# Altium project ESP_IoT_Dimmer.PrjPcb
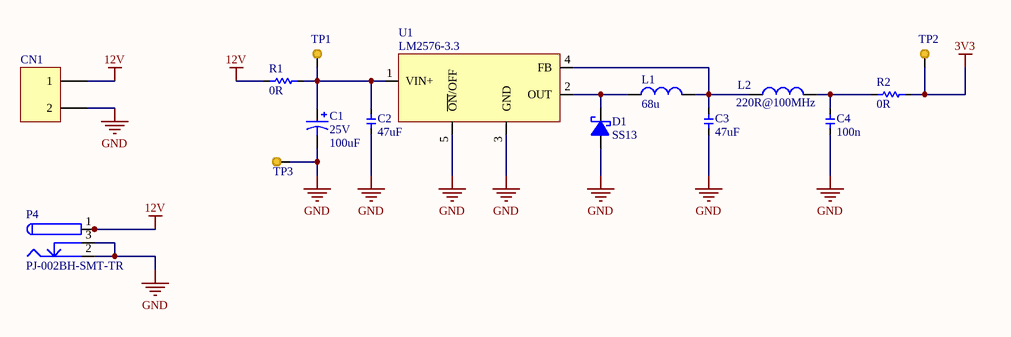
[diagram p0: 01_Power.SchDoc]
4 sheets, 65 parts. Net scope: flat (ports and power ports of the same name join across sheets).
Board file: PCB.PcbDoc
Sheets:
  01_Power.SchDoc
  00_TOP.SchDoc
  02_ESP12.SchDoc
  03_Dimmer.SchDoc

## Sheet 01_Power.SchDoc: Power
size A4; SheetNumber: 1; SheetTotal: 3; PageSetup: Record=PageOptions|CenterHorizontal=True|CenterVertical=True|PrintScale=1.09|XCorrection=1.00|YCorrection=1.00|PrintKind=0|BorderSize=5000000|LeftOffset=0|BottomOffset=0|Orientation=2|PaperLength=1000|PaperWidth=1000|Scale=100|PaperSource=7|PrintQuality=-3|MediaType=1|DitherType=10|PrintScaleMode=1|PaperKind=A4|PaperIndex=9; SK_ProjectName: ESP8266 IoT Dimmer; Version: R01

### Parts
C1  25V  value 100uF  [Electrolytic Cap 2.54mm]
C2  value 47uF  [CAPC_1411_3528_X08N]  (hidden comment: Cap)
C3  value 47uF  [CAPC_1411_3528_X08N]  (hidden comment: Cap)
C4  value 100n  [0603 - CAP]  (hidden comment: Cap)
CN1  Terminal 2 - 5mm  [Terminal 2]  (value not drawn)
D1  SS13  [SOD123F]
L1  value 68u  [IND_TH_SMD]  (hidden comment: Inductor)
L2  value 220R@100MHz  [0603]  (hidden comment: Inductor)
P4  PJ-002BH-SMT-TR  [PJ-002BH-SMT-TR]
R1  value 0R  [0603]  (hidden comment: Res)
R2  value 0R  [0603]  (hidden comment: Res)
TP1  Test Point 0.6mm  [TP_SMD_1mm]  (value not drawn)  (no BOM)
TP2  Test Point 0.6mm  [TP_SMD_1mm]  (value not drawn)  (no BOM)
TP3  Test Point 0.6mm  [TP_SMD_1mm]  (value not drawn)  (no BOM)
U1  LM2576-3.3  [TO263-5]

### Nets
3V3: R2.1 TP2.1
12V: CN1.1 P4.1 P4.1A R1.2
GND: C1.2 C2.1 C3.1 C4.1 CN1.2 D1.A P4.2 P4.3 TP3.1 U1.3(GND) U1.5(~{ON}/OFF)
NetC1_1: C1.1 C2.2 R1.1 TP1.1 U1.1(VIN+)
NetC3_2: C3.2 L1.2 L2.1 U1.4(FB)
NetC4_2: C4.2 L2.2 R2.2
NetD1_K: D1.K L1.1 U1.2(OUT)

### Notes on the sheet
- Title:
- Project:
- Version:
- sasakaranovic.com
- Sasa Karanovic
- Project available at
- Date:
- Time:
- Sheet
- of

### Library data of the parts
C1 = Cap Electrolytic: CAP ALUM 100UF 20% 25V RADIAL; Manufacturer: Nichicon; Manufacturer Part Number: UHE1E101MED; Distributor: DigiKey; Distributor Part Number: 493-1548-ND
C2 C3 = Cap: CAP TANT POLY47UF 20% 16V 1210; Manufacturer: AVX Corporation; Manufacturer Part Number: TCNT476M016R0200A; Distributor Part Number: 478-9595-1-ND; Distributor: DigiKey
C4 = Cap: Capacitor; Manufacturer: AVX Corporation; Manufacturer Part Number: 06035C104KAT2A; Distributor Part Number: 478-5052-1-ND; Distributor: DigiKey
CN1 = Terminal 2: TERM BLOCK PCB 2POS 5.0MM GREEN; Manufacturer: Phoenix Contact; Manufacturer Part Number: 1935161; Distributor: DigiKey; Distributor Part Number: 277-1667-ND
D1 = Diode Schotky: DIODE SCHOTTKY 30V 1A SMA; Manufacturer: ON Semiconductor; Manufacturer Part Number: SS13; Distributor: DigiKey; Distributor Part Number: SS13FSCT-ND
L1 = Inductor: FIXED IND 68UH 1A 289 MOHM SMD; Manufacturer: Laird-Signal Integrity Products; Manufacturer Part Number: TYS6045680M-10; Distributor: DigiKey; Distributor Part Number: 240-2747-1-ND
L2 = Inductor: FERRITE BEAD 220 OHM 0603 1LN; Manufacturer: Murata Electronics North America; Manufacturer Part Number: BLM18KG221SN1D; Distributor: DigiKey; Distributor Part Number: 490-5255-1-ND
P4 = DC Jack 2.5mm - Male: CONN PWR JACK 2.5X5.5MM SOLDER; Manufacturer: CUI Inc.; Manufacturer Part Number: PJ-002BH-SMT-TR; Distributor: DigiKey; Distributor Part Number: CP-002BHPJCT-ND
R1 R2 = Res: Resistor; Manufacturer: Yageo; Manufacturer Part Number: RC0603JR-070RL; Distributor: DigiKey; Distributor Part Number: 311-0.0GRCT-ND
TP1-TP3 = TP
U1 = LM2576-xx: Switching mode regulator [ 3v3, 5v, 12v and ADJ ]; Manufacturer: Microchip Technology; Manufacturer Part Number: LM2576-3.3WU; Distributor: DigiKey; Distributor Part Number: LM2576-3.3WU-ND

## Sheet 00_TOP.SchDoc: Top Level Schematic
size A4; SheetNumber: 1; SheetTotal: 3; PageSetup: Record=PageOptions|CenterHorizontal=True|CenterVertical=True|PrintScale=1.09|XCorrection=1.00|YCorrection=1.00|PrintKind=0|BorderSize=5000000|LeftOffset=0|BottomOffset=0|Orientation=2|PaperLength=1000|PaperWidth=1000|Scale=100|PaperSource=7|PrintQuality=-3|MediaType=1|DitherType=10|PrintScaleMode=1|PaperKind=A4|PaperIndex=9; SK_ProjectName: ESP8266 IoT Dimmer; Version: R01

### Notes on the sheet
- Title:
- Project:
- Version:
- sasakaranovic.com
- Sasa Karanovic
- Project available at
- Date:
- Time:
- Sheet
- of

## Sheet 02_ESP12.SchDoc: ESP12 Housing Board
size A4; SheetNumber: 1; SheetTotal: 3; PageSetup: Record=PageOptions|CenterHorizontal=True|CenterVertical=True|PrintScale=1.09|XCorrection=1.00|YCorrection=1.00|PrintKind=0|BorderSize=5000000|LeftOffset=0|BottomOffset=0|Orientation=2|PaperLength=1000|PaperWidth=1000|Scale=100|PaperSource=7|PrintQuality=-3|MediaType=1|DitherType=10|PrintScaleMode=1|PaperKind=A4|PaperIndex=9; SK_ProjectName: ESP8266 IoT Dimmer; Version: R01
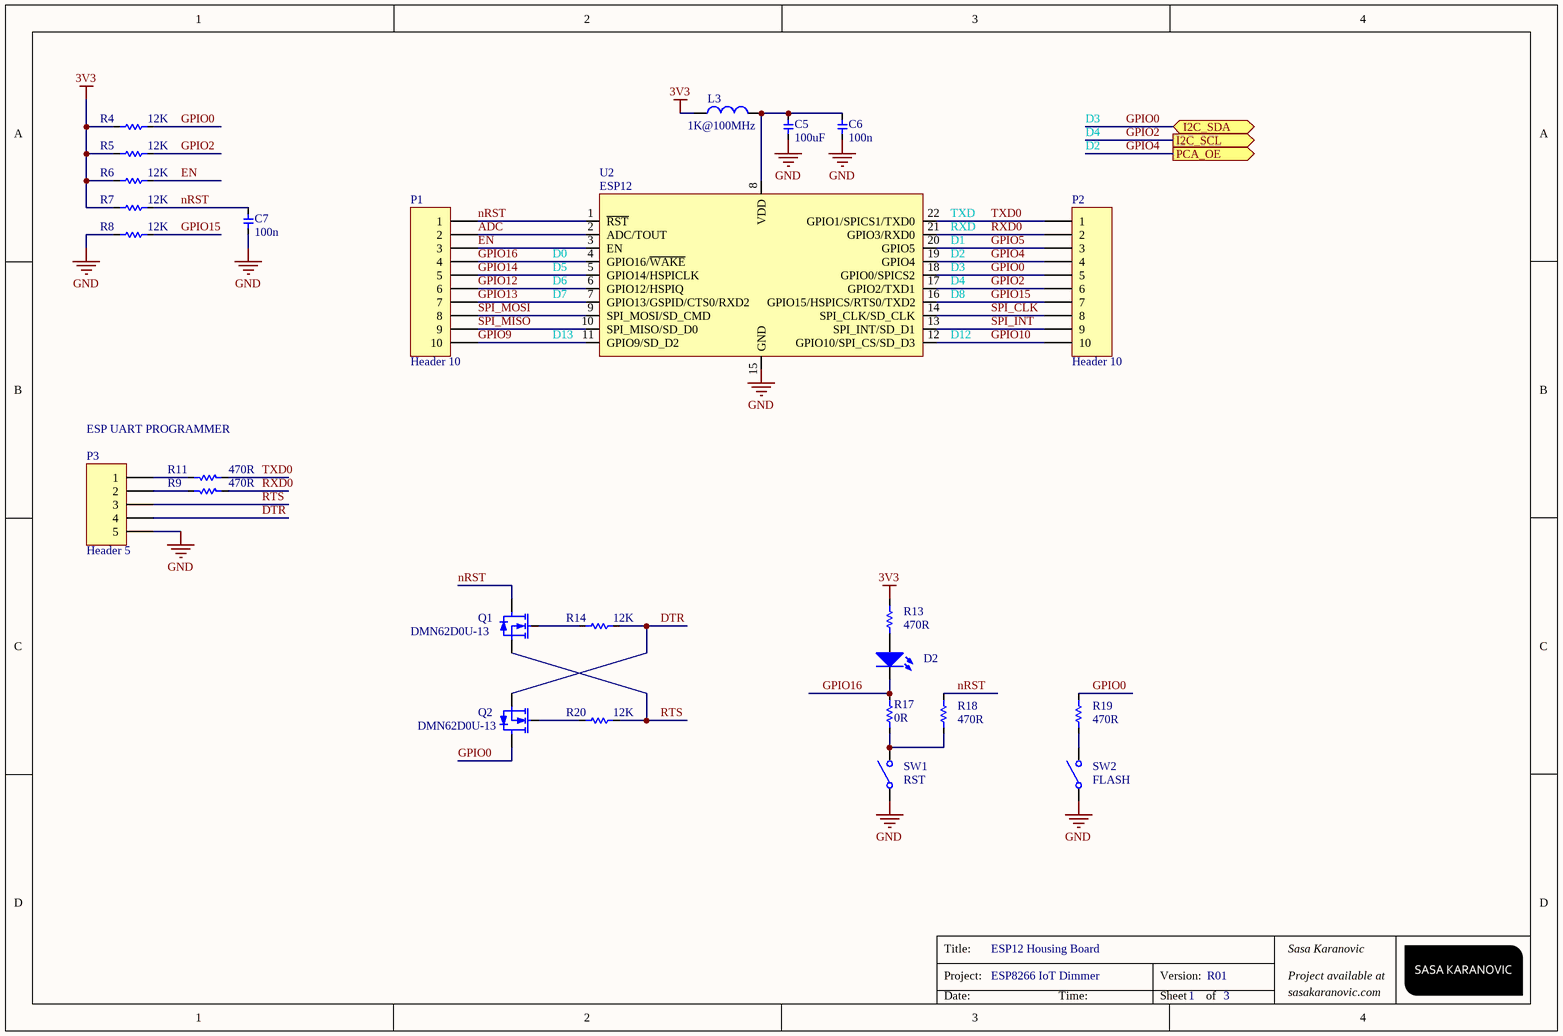
[diagram p1: 02_ESP12.SchDoc]

### Parts
C5  value 100uF  [CAPC_1411_3528_X08N]  (hidden comment: Cap)
C6  value 100n  [0603 - CAP]  (hidden comment: Cap)
C7  value 100n  [0603 - CAP]  (hidden comment: Cap)
D2  LED  [0603 Diode]  (value not drawn)
L3  value 1K@100MHz  [0603]  (hidden comment: Inductor)
P1  Header 10  [HDR1X10]
P2  Header 10  [HDR1X10]
P3  Header 5  [Header 5x1]
Q1  DMN62D0U-13  [SOT90P240X100-3N]
Q2  DMN62D0U-13  [SOT90P240X100-3N]
R4  value 12K  [0603]  (hidden comment: Res)
R5  value 12K  [0603]  (hidden comment: Res)
R6  value 12K  [0603]  (hidden comment: Res)
R7  value 12K  [0603]  (hidden comment: Res)
R8  value 12K  [0603]  (hidden comment: Res)
R9  value 470R  [0603]  (hidden comment: Res)
R11  value 470R  [0603]  (hidden comment: Res)
R13  value 470R  [0603]  (hidden comment: Res)
R14  value 12K  [0603]  (hidden comment: Res)
R17  value 0R  [0603]  (hidden comment: Res)
R18  value 470R  [0603]  (hidden comment: Res)
R19  value 470R  [0603]  (hidden comment: Res)
R20  value 12K  [0603]  (hidden comment: Res)
SW1  Switch  [SMD Switch 2pin]  (value not drawn)
SW2  Switch  [SMD Switch 2pin]  (value not drawn)
U2  ESP12  [ESP-12]

### Ports
I2C_SCL (out), I2C_SDA (bidir), PCA_OE (out)

### Nets
3V3: L3.1 R4.1 R5.1 R6.1 R7.1 R13.2
GND: C5.1 C6.1 C7.1 P3.5 R8.1 SW1.1(COMMON1) SW2.1(COMMON1) U2.15(GND)
ADC: P1.2 U2.2(ADC/TOUT)
DTR: P3.4 Q2.3(S) R14.2
EN: P1.3 R6.2 U2.3(EN)
GPIO0: P2.5 Q2.2(D) R4.2 R19.2 U2.18(GPIO0/SPICS2) ; port I2C_SDA
GPIO2: P2.6 R5.2 U2.17(GPIO2/TXD1) ; port I2C_SCL
GPIO4: P2.4 U2.19(GPIO4) ; port PCA_OE
GPIO5: P2.3 U2.20(GPIO5)
GPIO9: P1.10 U2.11(GPIO9/SD_D2)
GPIO10: P2.10 U2.12(GPIO10/SPI_CS/SD_D3)
GPIO12: P1.6 U2.6(GPIO12/HSPIQ)
GPIO13: P1.7 U2.7(GPIO13/GSPID/CTS0/RXD2)
GPIO14: P1.5 U2.5(GPIO14/HSPICLK)
GPIO15: P2.7 R8.2 U2.16(GPIO15/HSPICS/RTS0/TXD2)
GPIO16: D2.K P1.4 R17.1 U2.4(GPIO16/~{WAKE})
nRST: C7.2 P1.1 Q1.2(D) R7.2 R18.2 U2.1(~{RST})
RTS: P3.3 Q1.3(S) R20.2
RXD0: P2.2 R9.2 U2.21(GPIO3/RXD0)
SPI_CLK: P2.8 U2.14(SPI_CLK/SD_CLK)
SPI_INT: P2.9 U2.13(SPI_INT/SD_D1)
SPI_MISO: P1.9 U2.10(SPI_MISO/SD_D0)
SPI_MOSI: P1.8 U2.9(SPI_MOSI/SD_CMD)
TXD0: P2.1 R11.2 U2.22(GPIO1/SPICS1/TXD0)
NetC5_2: C5.2 C6.2 L3.2 U2.8(VDD)
NetD2_A: D2.A R13.1
NetP3_1: P3.1 R11.1
NetP3_2: P3.2 R9.1
NetQ1_1: Q1.1(G) R14.1
NetQ2_1: Q2.1(G) R20.1
NetR17_2: R17.2 R18.1 SW1.2(COMMON2)
NetR19_1: R19.1 SW2.2(COMMON2)

### Notes on the sheet
- D3
- D4
- D2
- (near U2) TXD
- (near U2) RXD
- (near U2) D1
- (near U2) D0
- (near U2) D5
- (near U2) D6
- (near U2) D7
- (near U2) D2
- (near U2) D3
- (near U2) D4
- (near U2) D8
- (near U2) D13
- (near U2) D12
- ESP UART PROGRAMMER
- (near SW1) RST
- (near SW2) FLASH
- Title:
- Project:
- Version:
- sasakaranovic.com
- Sasa Karanovic
- Project available at
- Date:
- Time:
- Sheet
- of

### Library data of the parts
C5 = Cap: Capacitor; Manufacturer: AVX Corporation; Manufacturer Part Number: TAJB107M006RNJ; Distributor Part Number: 478-3877-1-ND; Distributor: DigiKey
C6 C7 = Cap: as C4 on sheet 01_Power; Distributor Part Number: 478-5052-1-ND; Distributor: DigiKey
D2 = LED: Typical RED GaAs LED; Manufacturer: Lite-On Inc.; Manufacturer Part Number: LTST-C193KRKT-5A; Distributor: DigiKey; Distributor Part Number: 160-1830-1-ND
L3 = Inductor: FERRITE BEAD 1 KOHM 0603 1LN; Manufacturer: TDK Corporation; Manufacturer Part Number: MPZ1608S102ATA00; Distributor: DigiKey; Distributor Part Number: 445-8694-1-ND
P1 P2 = Header 10: Header, 10-Pin; Manufacturer: Harwin Inc.; Manufacturer Part Number: M20-9991046; Distributor: DigiKey; Distributor Part Number: 952-1843-ND
P3 = Header 5: SIL VERTICAL PC TAIL PIN HEADER; Manufacturer: Harwin Inc.; Manufacturer Part Number: M20-9990546; Distributor: DigiKey; Distributor Part Number: 952-2268-ND
Q1 Q2 = DMN62D0U-13: MOSFET N-CH 60V 0.38A; pin to pad: 1>2 2>3 3>1; Manufacturer: Diodes Incorporated; Manufacturer Part Number: DMN62D0U-13; Distributor: DigiKey; Distributor Part Number: DMN62D0U-13DICT-ND
R4-R8 R14 R20 = Res: Resistor; Manufacturer: Yageo; Manufacturer Part Number: RT0603FRE0712KL; Distributor: DigiKey; Distributor Part Number: YAG3353TR-ND
R9 R11 R13 R18 R19 = Res: Resistor; Manufacturer: Yageo; Manufacturer Part Number: AC0603FR-07470RL; Distributor: DigiKey; Distributor Part Number: 311-470LDCT-ND
R17 = Res: as R1 on sheet 01_Power; Distributor: DigiKey; Distributor Part Number: 311-0.0GRCT-ND
SW1 SW2 = Switch: Manufacturer: Harwin Inc.; Manufacturer Part Number: M20-9991046; Distributor: DigiKey; Distributor Part Number: 952-1843-ND
U2 = ESP12: ESP8266 SMT Module - ESP-12S; Manufacturer: Seeed Technology Co., Ltd; Manufacturer Part Number: 317060015; Distributor: DigiKey/eBay; Distributor Part Number: 317060015-ND

## Sheet 03_Dimmer.SchDoc: LED Dimmer
size A4; SheetNumber: 1; SheetTotal: 3; PageSetup: Record=PageOptions|CenterHorizontal=True|CenterVertical=True|PrintScale=1.09|XCorrection=1.00|YCorrection=1.00|PrintKind=0|BorderSize=5000000|LeftOffset=0|BottomOffset=0|Orientation=2|PaperLength=1000|PaperWidth=1000|Scale=100|PaperSource=7|PrintQuality=-3|MediaType=1|DitherType=10|PrintScaleMode=1|PaperKind=A4|PaperIndex=9; SK_ProjectName: ESP8266 IoT Dimmer; Version: R01
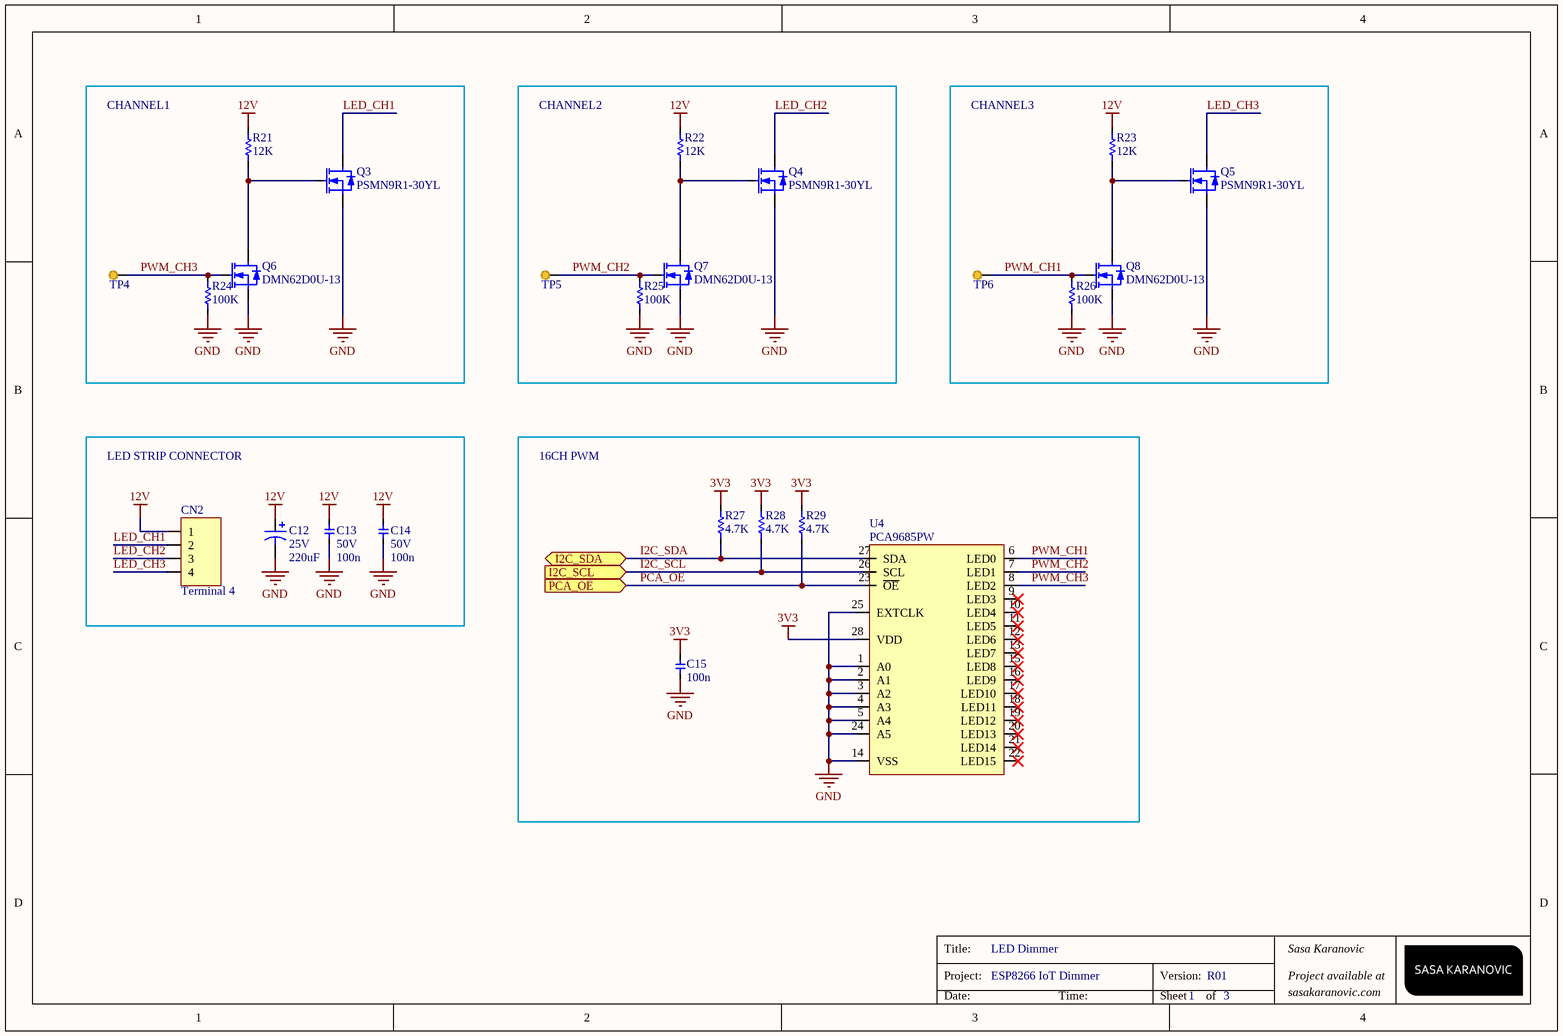
[diagram p2: 03_Dimmer.SchDoc]

### Parts
C12  25V  value 220uF  [Electrolytic Cap 2.54mm]
C13  50V  value 100n  [0603 - CAP]
C14  50V  value 100n  [0603 - CAP]
C15  value 100n  [0603 - CAP]  (hidden comment: Cap)
CN2  Terminal 4  [Terminal 4_90DEG]
Q3  PSMN9R1-30YL  [LFPAK-8]
Q4  PSMN9R1-30YL  [LFPAK-8]
Q5  PSMN9R1-30YL  [LFPAK-8]
Q6  DMN62D0U-13  [SOT90P240X100-3N]
Q7  DMN62D0U-13  [SOT90P240X100-3N]
Q8  DMN62D0U-13  [SOT90P240X100-3N]
R21  value 12K  [0603]  (hidden comment: Res)
R22  value 12K  [0603]  (hidden comment: Res)
R23  value 12K  [0603]  (hidden comment: Res)
R24  value 100K  [0603]  (hidden comment: Res)
R25  value 100K  [0603]  (hidden comment: Res)
R26  value 100K  [0603]  (hidden comment: Res)
R27  value 4.7K  [0603]  (hidden comment: Res)
R28  value 4.7K  [0603]  (hidden comment: Res)
R29  value 4.7K  [0603]  (hidden comment: Res)
TP4  Test Point 0.6mm  [TP_SMD_1mm]  (value not drawn)  (no BOM)
TP5  Test Point 0.6mm  [TP_SMD_1mm]  (value not drawn)  (no BOM)
TP6  Test Point 0.6mm  [TP_SMD_1mm]  (value not drawn)  (no BOM)
U4  PCA9685PW  [TSOP65P640X100-28N]

### Blocks framed on the sheet
CHANNEL1: Q3 Q6 R21 R24 TP4
CHANNEL2: Q4 Q7 R22 R25 TP5
CHANNEL3: Q5 Q8 R23 R26 TP6
LED STRIP CONNECTOR: C12-C14 CN2
16CH PWM: C15 R27-R29 U4

### Ports
I2C_SCL (in), I2C_SDA (bidir), PCA_OE (in)

### Nets
3V3: C15.2 R27.2 R28.2 R29.2 U4.28(VDD)
12V: C12.1 C13.2 C14.2 CN2.1 R21.2 R22.2 R23.2
GND: C12.2 C13.1 C14.1 C15.1 Q3.S Q4.S Q5.S Q6.3(S) Q7.3(S) Q8.3(S) R24.1 R25.1 R26.1 U4.1(A0) U4.2(A1) U4.3(A2) U4.4(A3) U4.5(A4) U4.14(VSS) U4.24(A5) U4.25(EXTCLK)
I2C_SCL: R28.1 U4.26(SCL) ; port I2C_SCL  [project net GPIO2]
I2C_SDA: R27.1 U4.27(SDA) ; port I2C_SDA  [project net GPIO0]
LED_CH1: CN2.2 Q3.D
LED_CH2: CN2.3 Q4.D
LED_CH3: CN2.4 Q5.D
PCA_OE: R29.1 U4.23(~{OE}) ; port PCA_OE  [project net GPIO4]
PWM_CH1: Q8.1(G) R26.2 TP6.1 U4.6(LED0)
PWM_CH2: Q7.1(G) R25.2 TP5.1 U4.7(LED1)
PWM_CH3: Q6.1(G) R24.2 TP4.1 U4.8(LED2)
NetQ3_G: Q3.G Q6.2(D) R21.1
NetQ4_G: Q4.G Q7.2(D) R22.1
NetQ5_G: Q5.G Q8.2(D) R23.1

Not connected (* = marked no-connect by the designer): U4 9(LED3)* 10(LED4)* 11(LED5)* 12(LED6)* 13(LED7)* 15(LED8)* 16(LED9)* 17(LED10)* 18(LED11)* 19(LED12)* 20(LED13)* 21(LED14)* 22(LED15)*

### Notes on the sheet
- Title:
- Project:
- Version:
- sasakaranovic.com
- Sasa Karanovic
- Project available at
- Date:
- Time:
- Sheet
- of

### Library data of the parts
C12 = Cap Electrolytic: Polarized Capacitor (Axial); Manufacturer: Yageo; Manufacturer Part Number: AC0603FR-07470RL; Distributor: DigiKey; Distributor Part Number: 311-470LDCT-ND
C13-C15 = Cap: as C4 on sheet 01_Power; Distributor Part Number: 478-5052-1-ND; Distributor: DigiKey
CN2 = Terminal 4: TERM BLOCK PCB 4POS 5.0MM GREEN; Manufacturer: Phoenix Contact; Manufacturer Part Number: 1935187; Distributor: DigiKey; Distributor Part Number: 277-1579-ND
Q3-Q5 = PSMN9R1-30YL: MOSFET N-CH 30V 37A LFPAK; Manufacturer: Nexperia USA Inc.; Manufacturer Part Number: PSMN011-30YLC,115; Distributor: DigiKey; Distributor Part Number: 1727-6495-1-ND
Q6-Q8 = DMN62D0U-13: MOSFET N-CH 60V 0.38A; pin to pad: 1>2 2>3 3>1; Manufacturer: Diodes Incorporated; Manufacturer Part Number: DMN62D0U-13; Distributor: DigiKey; Distributor Part Number: DMN62D0U-13DICT-ND
R21-R23 = Res: as R4 on sheet 02_ESP12; Distributor: DigiKey; Distributor Part Number: YAG3353TR-ND
R24-R26 = Res: Resistor; Manufacturer: Yageo; Manufacturer Part Number: RT0603BRD07100KL; Distributor: DigiKey; Distributor Part Number: YAG1235CT-ND
R27-R29 = Res: Resistor; Manufacturer: Yageo; Manufacturer Part Number: RT0603FRE074K7L; Distributor: DigiKey; Distributor Part Number: YAG1238CT-ND
TP4-TP6 = TP
U4 = PCA9685: IC LED DRIVER RGBA 28-TSSOP; Manufacturer: NXP USA Inc.; Manufacturer Part Number: PCA9685PW,118; Distributor: DigiKey; Distributor Part Number: 568-11925-1-ND

## Nets that join several sheets
3V3: 01_Power (R2.1 TP2.1), 02_ESP12 (6 pins), 03_Dimmer (5 pins)
12V: 01_Power (CN1.1 P4.1 P4.1A R1.2), 03_Dimmer (7 pins)
GND: 01_Power (11 pins), 02_ESP12 (8 pins), 03_Dimmer (21 pins)
GPIO0: 02_ESP12 (5 pins), 03_Dimmer (R27.1 U4.27)
GPIO2: 02_ESP12 (P2.6 R5.2 U2.17), 03_Dimmer (R28.1 U4.26)
GPIO4: 02_ESP12 (P2.4 U2.19), 03_Dimmer (R29.1 U4.23)